# Altium schematic sheet veniceB-IRController-TopLevel-B.SchDoc
size A
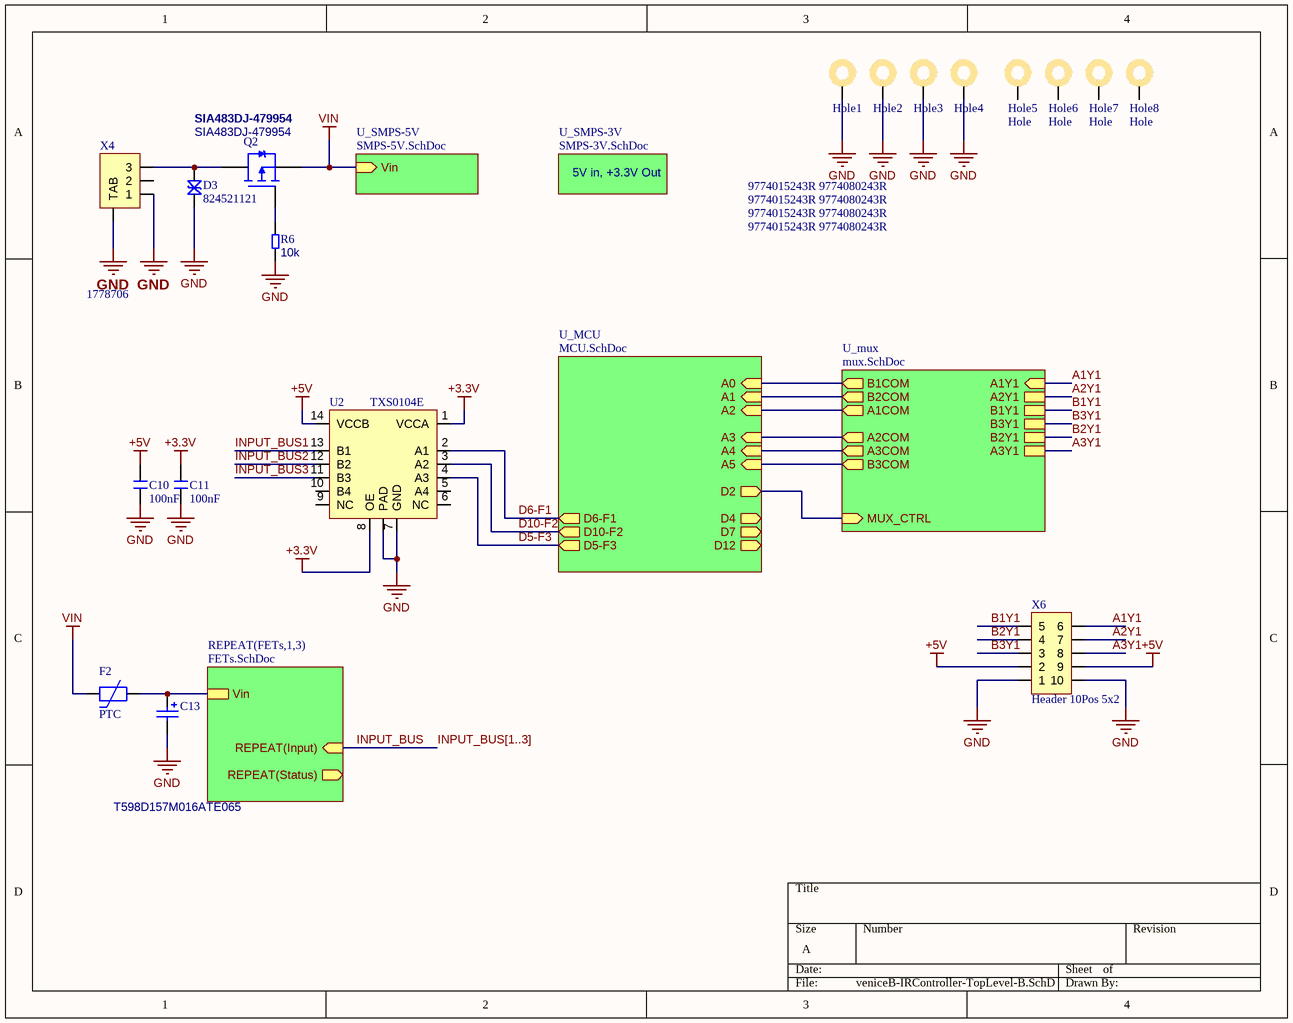
[diagram p0: veniceB-IRController-TopLevel-B.SchDoc]

## Parts
C10  100nF  [C0603_N]
C11  100nF  [C0603_N]
C13  T598D157M016ATE065  [2917 - Case D]
D3  824521121  [DO214AC SMA]
F2  PTC  [1812]
Hole1  9774015243R 9774080243R  [Insert-Thread-SMD-M2]
Hole2  9774015243R 9774080243R  [Insert-Thread-SMD-M2]
Hole3  9774015243R 9774080243R  [Insert-Thread-SMD-M2]
Hole4  9774015243R 9774080243R  [Insert-Thread-SMD-M2]
Hole5  Hole  [M2.5 HOLE]
Hole6  Hole  [M2.5 HOLE]
Hole7  Hole  [M2.5 HOLE]
Hole8  Hole  [M2.5 HOLE]
Q2  SIA483DJ-479954  [SC70-6L]
R6  10k  [R0603]
U2  TXS0104E  [QFN-14]
X4  1778706  [PTSM-3W-V-SMD]
X6  Header 10Pos 5x2  [Header 5x2 SMD 2.54mm]

## Sub-sheets
REPEAT(FETs,1,3) = FETs.SchDoc: REPEAT(Input) (in), REPEAT(Status) (out), Vin
U_MCU = MCU.SchDoc: D10-F2 (out), D6-F1 (out), D5-F3 (out), D7 (out), D12 (out), D2 (out), D4 (out), A4 (in), A2 (in), A0 (in), A1 (in), A3 (in), A5 (in)
U_mux = mux.SchDoc: MUX_CTRL (in), A2COM (out), A1COM (out), B3COM (out), A3COM (out), B2COM (out), B1COM (out), A1Y1 (in), A2Y1, B1Y1, B3Y1, B2Y1, A3Y1
U_SMPS-3V = SMPS-3V.SchDoc: no entries
U_SMPS-5V = SMPS-5V.SchDoc: Vin (in)

## Nets
+3.3V: C11.1 U2.1(VCCA) U2.8(OE)
+5V: C10.1 U2.14(VCCB) X6.2 X6.9
GND: C10.2 C11.2 C13.2 D3.1 Hole1.1 Hole2.1 Hole3.1 Hole4.1 R6.1 U2.7(GND) U2.PAD X4.1 X4.TAB X6.1 X6.10
VIN: F2.1 Q2.S ; sheet U_SMPS-5V/Vin
A1Y1: X6.6 ; sheet U_mux/A1Y1
A2Y1: X6.7 ; sheet U_mux/A2Y1
A3Y1: X6.8 ; sheet U_mux/A3Y1
B1Y1: X6.5 ; sheet U_mux/B1Y1
B2Y1: X6.4 ; sheet U_mux/B2Y1
B3Y1: X6.3 ; sheet U_mux/B3Y1
D5-F3: U2.4(A3) ; sheet U_MCU/D5-F3
D6-F1: U2.2(A1) ; sheet U_MCU/D6-F1
D10-F2: U2.3(A2) ; sheet U_MCU/D10-F2
INPUT_BUS: sheet REPEAT(FETs,1,3)/REPEAT(Input)
INPUT_BUS1: U2.13(B1)
INPUT_BUS2: U2.12(B2)
INPUT_BUS3: U2.11(B3)
NetC13_1: C13.1 F2.2 ; sheet REPEAT(FETs,1,3)/Vin
NetD3_2: D3.2 Q2.D X4.3
NetQ2_G: Q2.G R6.2
(unnamed): sheet U_MCU/D2, sheet U_mux/MUX_CTRL
(unnamed): sheet U_MCU/A4, sheet U_mux/A3COM
(unnamed): sheet U_MCU/A2, sheet U_mux/A1COM
(unnamed): sheet U_MCU/A0, sheet U_mux/B1COM
(unnamed): sheet U_MCU/A1, sheet U_mux/B2COM
(unnamed): sheet U_MCU/A3, sheet U_mux/A2COM
(unnamed): sheet U_MCU/A5, sheet U_mux/B3COM

Not connected (* = marked no-connect by the designer): Hole5 1; Hole6 1; Hole7 1; Hole8 1; U2 5(A4) 6(NC) 9(NC) 10(B4); X4 2

## Buses and harness runs
bus INPUT_BUS[1..3]

## Notes on the sheet
- 5V in, +3.3V Out

## Library data of the parts
C10 C11 = Capacitor: Capacitor MLCC; Manufacturer: Yageo; Manufacturer Part Number: CC0603KRX7R9BB104; Tolerance (%): 10; Category: Capacitor; Package: 0603; Value: 100nF; Supplier Part Number 1: 1362556; Supplier 1: Farnell; ComponentLink1URL: http://www.yageo.com; ComponentLink1Description: Manufacturer Website; Voltage Rating (Volts): *; Supplier 2: Digi-Key; Supplier Part Number 2: 311-1344-1-ND
C13 = Capacitor Polarized: Polarized Cap; Published: 17-Jul-2002; LatestRevisionDate: 19-Mar-2004; LatestRevisionNote: Silkscreen dimensions re-sized.; DatasheetDocument: Mar-2001; PackageDocument: Mar-2001; PackageReference: D; Publisher: Altium Limited; Code_JEITA: 7343-31; ComponentLink1Description: Manufacturer Link; ComponentLink1URL: http://www.kemet.com/; ComponentLink2Description: Datasheet; ComponentLink2URL: http://www.kemet.com/kemet/web/homepage/kechome.nsf/vapubfilesname/F3102TA.pdf/$file/F3102TA.pdf; Value: T598D157M016ATE065
D3 = TVS Bidirectional
F2 = PTC: PTC, Resettable Fuse
Hole1-Hole4 = Hole
Q2 = MOSFET P CH: Value: SIA483DJ-479954
R6 = Resistor: Published: 17-Dec-2003; LatestRevisionDate: 19-Mar-2004; LatestRevisionNote: Silkscreen size reduced.; PackageDocument: Mar-2003; PackageReference: 3-0603; Publisher: Altium Limited; Code_IPC: 1608 [0603]; ComponentLink1Description: Manufacturer Link; ComponentLink1URL: http://www.panasonic.com/industrial/components/resistive_products.htm; ComponentLink2Description: Datasheet; ComponentLink2URL: http://www.panasonic.com/industrial/components/pdf/AOA0000CE2.pdf; Value: 10k
X4 = Connector 3W - TAB